# EAGLE design Domino Pi (EAGLE 6.5.0)
Domino breakout Board
DATABASE: ./../Common/BOM/Domino_DB.txt; DRAWN: M.STEMPIN; REV: D
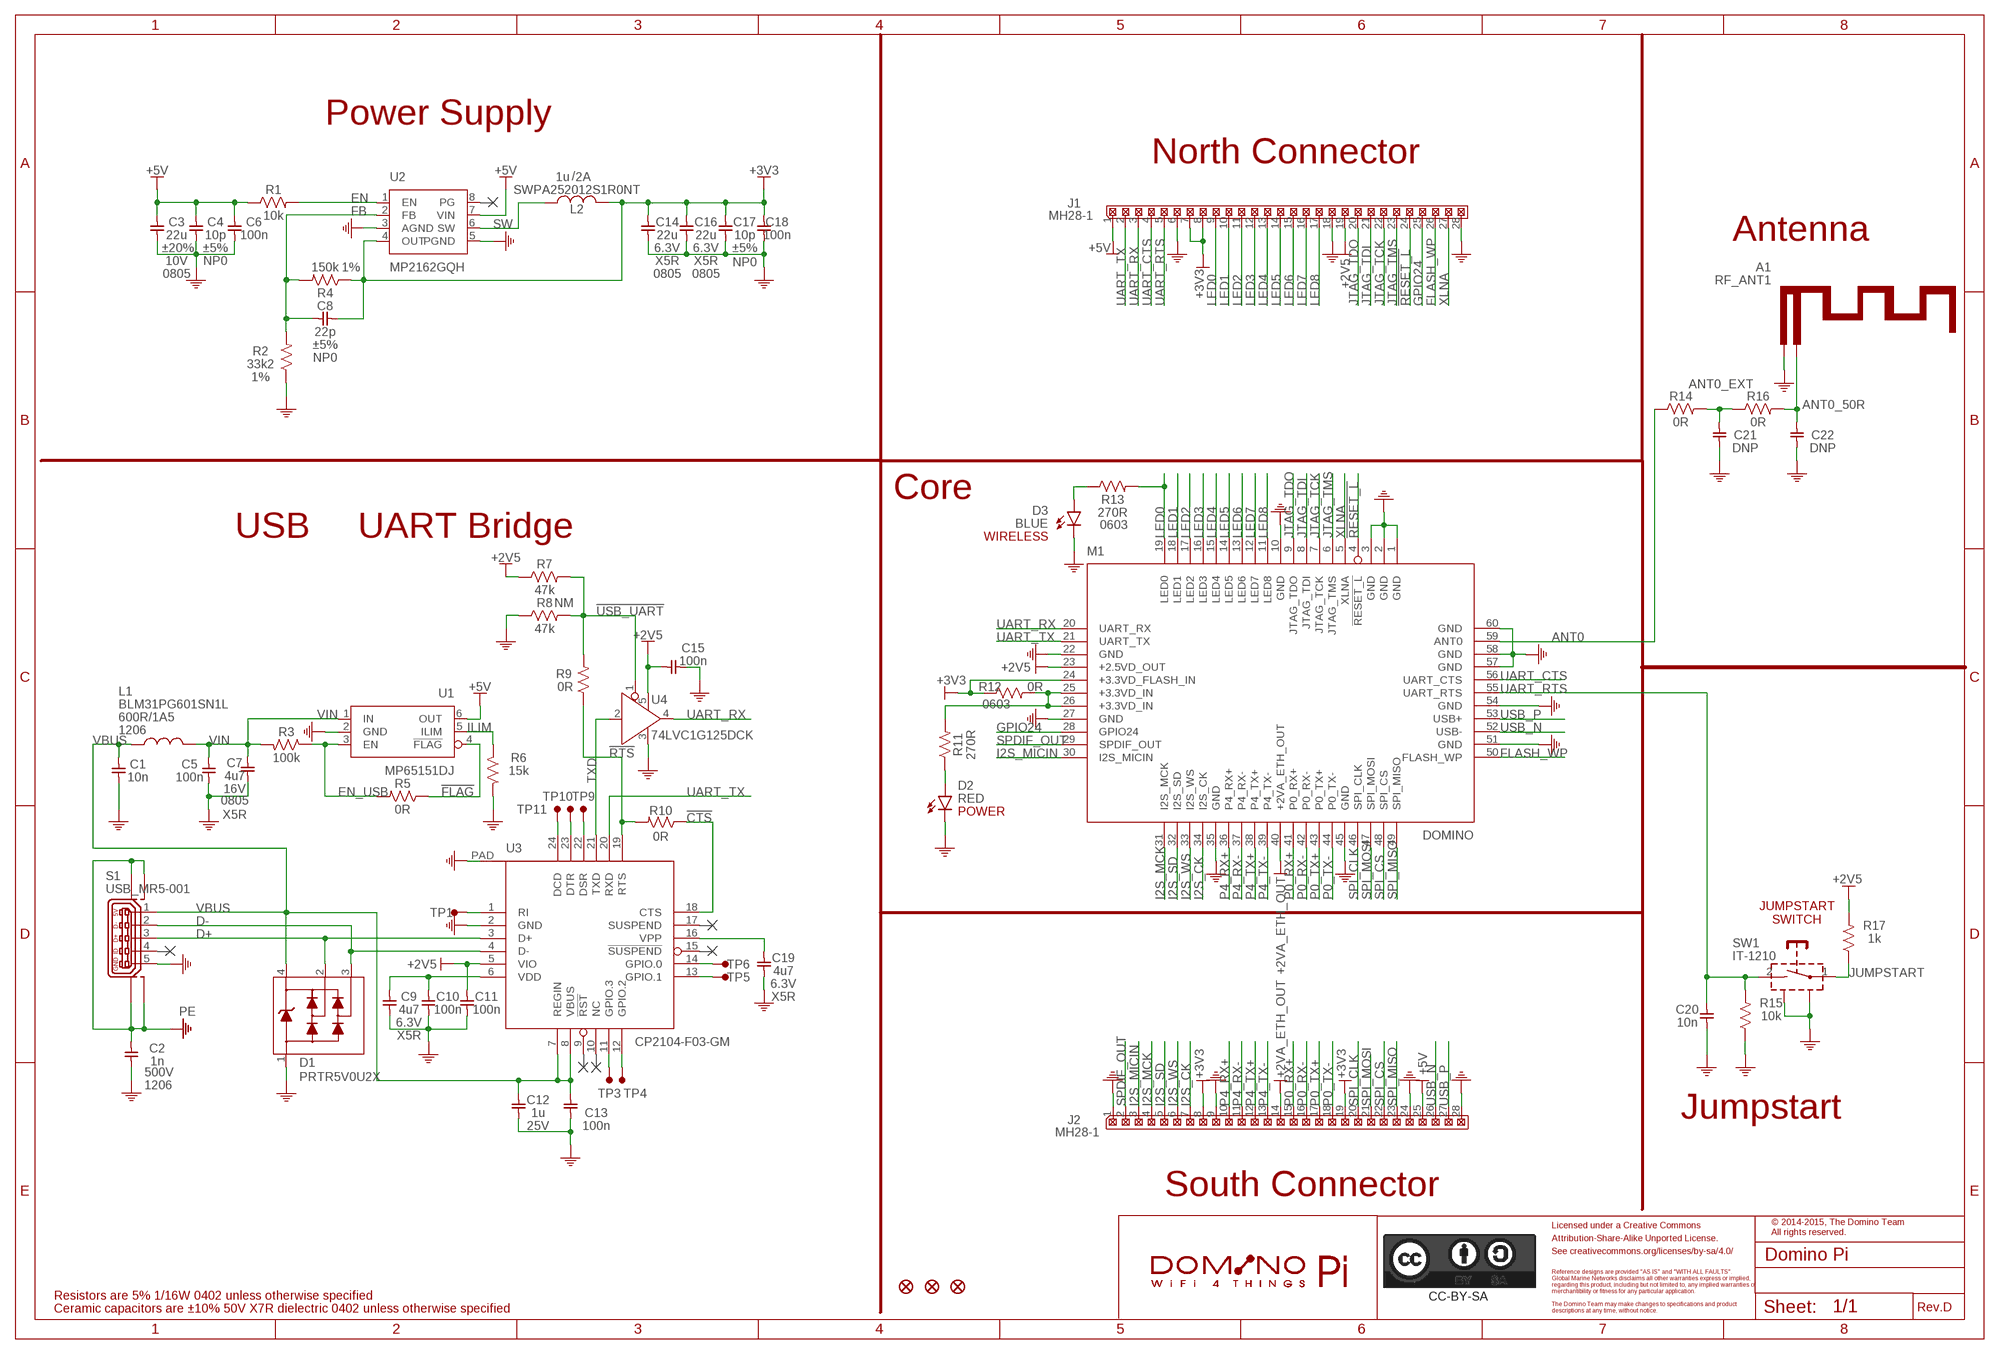
[diagram p0: schematic, sheet 1]
PORT1 (NC): BOM: EXCLUDE
PORT2 (NC): BOM: EXCLUDE
PORT7 (NC): BOM: EXCLUDE
PORT8 (NC): BOM: EXCLUDE
PORT13 (NC): BOM: EXCLUDE
PORT16 (NC): BOM: EXCLUDE

## Parts
A1  RF_ANT1  [RF_ANT1]
C1  10n  CAP_0402  [C0402]
C2  1n  CAP_1206  [C1206]
C3  22u  CAP_0805  [C0805]
C4  10p  CAP_0402  [C0402]
C5  100n  CAP_0402  [C0402]
C6  100n  CAP_0402  [C0402]
C7  4u7  CAP_0805  [C0805]
C8  22p  CAP_0402  [C0402]
C9  4u7  CAP_0402  [C0402]
C10  100n  CAP_0402  [C0402]
C11  100n  CAP_0402  [C0402]
C12  1u  CAP_0402  [C0402]
C13  100n  CAP_0402  [C0402]
C14  22u  CAP_0805  [C0805]
C15  100n  CAP_0402  [C0402]
C16  22u  CAP_0805  [C0805]
C17  10p  CAP_0402  [C0402]
C18  100n  CAP_0402  [C0402]
C19  4u7  CAP_0402  [C0402]
C20  10n  CAP_0402  [C0402]
C21  DNP  CAP_0402  [C0402]
C22  DNP  CAP_0402  [C0402]
CC-BY-SA  CC-BY-SA_LOGO  [CC-BY-SA_LOGO]
D1  PRTR5V0U2X  [SOT143B]
D2  RED  LED_0402  [LED0402]
D3  BLUE  LED_0402  [LED0402]
F1  FIDUCIAL  [FIDUCIAL]
F2  FIDUCIAL  [FIDUCIAL]
F3  FIDUCIAL  [FIDUCIAL]
J1  MH28-1  [MH28-1-0.1]
J2  MH28-1  [MH28-1-0.1]
L1  BLM31PG601SN1L  FB_1206  [FB1206]
L2  SWPA252012S1R0NT  [SWPA252012S]
M1  DOMINO  [DOMINO]
R1  10k  RES_0402  [R0402]
R2  33k2  RES_0402  [R0402]
R3  100k  RES_0402  [R0402]
R4  150k  RES_0402  [R0402]
R5  0R  RES_0402  [R0402]
R6  15k  RES_0402  [R0402]
R7  47k  RES_0402  [R0402]
R8  47k  RES_0402  [R0402]
R9  0R  RES_0402  [R0402]
R10  0R  RES_0402  [R0402]
R11  270R  RES_0402  [R0402]
R12  0R  RES_0603  [R0603]
R13  270R  RES_0603  [R0603]
R14  0R  RES_0402  [R0402]
R15  10k  RES_0402  [R0402]
R16  0R  RES_0402  [R0402]
R17  1k  RES_0402  [R0402]
S1  USB_MR5-001  [USB-MR5-001]
SW1  IT-1210  [IT-1210]
TP1  TEST_PAD  [TEST_PAD]
TP3  TEST_PAD  [TEST_PAD]
TP4  TEST_PAD  [TEST_PAD]
TP5  TEST_PAD  [TEST_PAD]
TP6  TEST_PAD  [TEST_PAD]
TP9  TEST_PAD  [TEST_PAD]
TP10  TEST_PAD  [TEST_PAD]
TP11  TEST_PAD  [TEST_PAD]
U1  MP65151DJ  [SOT23-6]
U2  MP2162GQH  [QFN-8_2X1.5]
U3  CP2104-F03-GM  [QFN-25_4X4]
U4  74LVC1G125DCK  [SC70]
W1  DOMINO_PI_LOGO  [DOMINO_PI_LOGO]

## Nets
!CTS: R10.1 U3.18(CTS)
!FLAG: R5.1 U1.4(!FLAG)
!RESET_L: J1.24 M1.4(!RESET_L)
!RTS: R9.1 R10.2 U3.19(RTS)
!USB_UART: R7.2 R8.2 R9.2 U4.1(!OE)
+2V5: C11.1 C15.2 J1.19 M1.23(+2.5VD_OUT) R7.1 R17.2 U3.5(VIO) U4.5(VCC)
+2VA_ETH_OUT [Ethernet]: J2.14 M1.40(+2VA_ETH_OUT)
+3.3VD_IN: M1.25(+3.3VD_IN) M1.26(+3.3VD_IN) R11.2 R12.2
+3V3: C8.2 C14.1 C16.1 C17.1 C18.1 J1.7 J1.8 J2.8 J2.19 L2.2 M1.24(+3.3VD_FLASH_IN) R4.1 R12.1 U2.4(OUT)
+5V: C3.1 C4.1 C6.1 J1.1 J2.25 R1.1 U1.6(OUT) U2.7(VIN)
ANT0 [RF]: M1.59(ANT0) R14.1
ANT0_50R [RF]: A1.FEED C22.1 R16.2
ANT0_EXT [RF]: C21.1 R14.2 R16.1
BLUE_LED: D3.2(A) R13.1
D+ [USB]: D1.2 S1.3 U3.3(D+)
D- [USB]: D1.3 S1.2 U3.4(D-)
EN: R1.2 U2.1(EN)
EN_USB: R3.1 R5.2 U1.3(EN)
FB: C8.1 R2.2 R4.2 U2.2(FB)
FLASH_WP: J1.26 M1.50(FLASH_WP)
GND: A1.GND C1.2 C2.2 C3.2 C4.2 C5.2 C6.2 C7.2 C9.2 C10.2 C11.2 C12.2 C13.2 C14.2 C15.1 C16.2 C17.2 C18.2 C19.2 C20.2 C21.2 C22.2 D1.1 D2.1(C) D3.1(C) J1.6 J1.18 J1.28 J2.1 J2.9 J2.24 J2.28 M1.1(GND) M1.2(GND) M1.3(GND) M1.10(GND) M1.22(GND) M1.27(GND) M1.35(GND) M1.45(GND) M1.51(GND) M1.54(GND) M1.57(GND) M1.58(GND) M1.60(GND) R2.1 R6.2 R8.1 R15.1 S1.5 SW1.SH$1 SW1.SH$2 U1.2(GND) U2.3(AGND) U2.5(PGND) U3.2(GND) U3.PAD U4.3(GND)
GPIO24: J1.25 M1.28(GPIO24)
I2S_CK: J2.7 M1.34(I2S_CK)
I2S_MCK: J2.4 M1.31(I2S_MCK)
I2S_MICIN: J2.3 M1.30(I2S_MICIN)
I2S_SD: J2.5 M1.32(I2S_SD)
I2S_WS: J2.6 M1.33(I2S_WS)
ILIM: R6.1 U1.5(ILIM)
JTAG_TCK: J1.22 M1.7(JTAG_TCK)
JTAG_TDI: J1.21 M1.8(JTAG_TDI)
JTAG_TDO: J1.20 M1.9(JTAG_TDO)
JTAG_TMS: J1.23 M1.6(JTAG_TMS)
JUMPSTART: R17.1 SW1.1
LED0: J1.9 M1.19(LED0) R13.2
LED1: J1.10 M1.18(LED1)
LED2: J1.11 M1.17(LED2)
LED3: J1.12 M1.16(LED3)
LED4: J1.13 M1.15(LED4)
LED5: J1.14 M1.14(LED5)
LED6: J1.15 M1.13(LED6)
LED7: J1.16 M1.12(LED7)
LED8: J1.17 M1.11(LED8)
N$1: D2.2(A) R11.1
N$2: TP9.1(PP) U3.22(DSR)
N$6: TP1.1(PP) U3.1(RI)
N$8: TP3.1(PP) U3.11(GPIO.3)
N$9: TP4.1(PP) U3.12(GPIO.2)
N$12: TP10.1(PP) U3.23(DTR)
N$13: TP11.1(PP) U3.24(DCD)
N$15: TP6.1(PP) U3.14(GPIO.0)
N$16: TP5.1(PP) U3.13(GPIO.1)
N$31: C19.1 U3.16(VPP)
P0_RX+ [Ethernet]: J2.15 M1.41(P0_RX+)
P0_RX- [Ethernet]: J2.16 M1.42(P0_RX-)
P0_TX+ [Ethernet]: J2.17 M1.43(P0_TX+)
P0_TX- [Ethernet]: J2.18 M1.44(P0_TX-)
P4_RX+ [Ethernet]: J2.10 M1.36(P4_RX+)
P4_RX- [Ethernet]: J2.11 M1.37(P4_RX-)
P4_TX+ [Ethernet]: J2.12 M1.38(P4_TX+)
P4_TX- [Ethernet]: J2.13 M1.39(P4_TX-)
PE: C2.1 S1.SH$1(M0) S1.SH$2(M1) S1.SH$3(M2) S1.SH$4(M3)
SPDIF_OUT: J2.2 M1.29(SPDIF_OUT)
SPI_CLK: J2.20 M1.46(SPI_CLK)
SPI_CS: J2.22 M1.48(SPI_CS)
SPI_MISO: J2.23 M1.49(SPI_MISO)
SPI_MOSI: J2.21 M1.47(SPI_MOSI)
SW: L2.1 U2.6(SW)
TXD: U3.21(TXD) U4.2(A)
UART_CTS: J1.4 M1.56(UART_CTS)
UART_RTS: C20.1 J1.5 M1.55(UART_RTS) R15.2 SW1.2
UART_RX: J1.3 M1.20(UART_RX) U4.4(Y)
UART_TX: J1.2 M1.21(UART_TX) U3.20(RXD)
USB_N [USB]: J2.26 M1.52(USB-)
USB_P [USB]: J2.27 M1.53(USB+)
VBUS: C1.1 C12.1 C13.1 D1.4 L1.2 S1.1 U3.7(REGIN) U3.8(VBUS)
VDD: C9.1 C10.1 U3.6(VDD)
VIN: C5.1 C7.1 L1.1 R3.2 U1.1(IN)
XLNA: J1.27 M1.5(XLNA)
Unconnected: S1.4 U2.8(PG) U3.9(!RST) U3.10(NC) U3.15(!SUSPEND) U3.17(SUSPEND)

## Notes on the sheet
- Power Supply
- North Connector
- /
- Antenna
- Core
- WIRELESS
- USB ⇔ UART Bridge
- NM
- POWER
- JUMPSTART
  SWITCH
- Jumpstart
- South Connector
- Licensed under a Creative Commons
- © 2014-2015, The Domino Team
  All rights reserved.
- Attribution-Share-Alike Unported License.
- See creativecommons.org/licenses/by-sa/4.0/
- Reference designs are provided "AS IS" and "WITH ALL FAULTS".
- Global Marine Networks disclaims all other warranties express or implied,
- regarding this product, including but not limited to, any implied warranties of
- merchantibility or fitness for any particular application.
- Resistors are 5% 1/16W 0402 unless otherwise specified
- The Domino Team may make changes to specifications and product
- Ceramic capacitors are ±10% 50V X7R dielectric 0402 unless otherwise specified | descriptions at any time, without notice. | Rev.

## Library data of the parts
A1 = Domino:RF_ANT1: 2.4 GHz PCB WiFi Antenna; BOM: EXCLUDE; PARTNO: WIFI_ANT-2.4GHz
C1 C20 = Domino:CAP_: Capacitor; PARTNO: C0402_10n_X7R_10%_CER_50V; SIZE: 0402; TC: X7R; TOL: ±10%; TYPE: CER; VOLT: 50V
C2 = Domino:CAP_: Capacitor; PARTNO: C1206_1n_X7R_10%_CER_500V; SIZE: 1206; TC: X7R; TOL: ±10%; TYPE: CER; VOLT: 500V
C3 = Domino:CAP_: Capacitor; PARTNO: C1206_22u_X7R_20%_CER_10V; SIZE: 0805; TC: X7R; TOL: ±20%; TYPE: CER; VOLT: 10V
C4 C17 = Domino:CAP_: Capacitor; PARTNO: C0402_10p_NP0_5%_CER_50V; SIZE: 0402; TC: NP0; TOL: ±5%; TYPE: CER; VOLT: 50V
C5 C6 C10 C11 C13 C15 C18 = Domino:CAP_: Capacitor; PARTNO: C0402_100n_X7R_10%_CER_50V; SIZE: 0402; TC: X7R; TOL: ±10%; TYPE: CER; VOLT: 50V
C7 = Domino:CAP_: Capacitor; PARTNO: C0805_4u7_X5R_10%_CER_16V; SIZE: 0805; TC: X5R; TOL: ±10%; TYPE: CER; VOLT: 16V
C8 = Domino:CAP_: Capacitor; PARTNO: C0402_22p_NP0_5%_CER_50V; SIZE: 0402; TC: NP0; TOL: ±5%; TYPE: CER; VOLT: 50V
C9 C19 = Domino:CAP_: Capacitor; PARTNO: C0402_4u7_X5R_10%_CER_6V3; SIZE: 0402; TC: X5R; TOL: ±10%; TYPE: CER; VOLT: 6.3V
C12 = Domino:CAP_: Capacitor; PARTNO: C0402_1u_X7R_10%_CER_25V; SIZE: 0402; TC: X7R; TOL: ±10%; TYPE: CER; VOLT: 25V
C14 C16 = Domino:CAP_: Capacitor; PARTNO: C0805_22u_X5R_20%_CER_6V3; SIZE: 0805; TC: X5R; TOL: ±20%; TYPE: CER; VOLT: 6.3V
C21 C22 = Domino:CAP_: Capacitor; DNP: T; PARTNO: C0402_DNP; SIZE: 0402
CC-BY-SA = Domino:CC-BY-SA_LOGO: Attribution-Share-Alike Unported License See creativecommons.org/licenses/by-sa/3.0/ for details.; BOM: EXCLUDE
D1 = Domino:PRTR5V0U2X: Ultra low capacitance double rail-to-rail ESD protection diode; PARTNO: PRTR5V0U2X; RATE: 300W; VOLT: 5V
D2 = Domino:LED_: LED; PARTNO: LED0402-RED
D3 = Domino:LED_: LED; PARTNO: LED0402-BLUE
F1-F3 = Domino:FIDUCIAL: Fiducial Mark; BOM: EXCLUDE
J1 J2 = Domino:MH28-1: 28x1 Pin Male Header; PARTNO: MH28-1-0.1
L1 = Domino:FB_: Ferrite Bead; OPT: 600R/1A5; PARTNO: BLM31PG601SN1L; SIZE: 1206
L2 = Domino:SWPA252012S*?: 2.0 x 1.5 mm Footprint 1.2mm Height Shielded Inductor; INDUCTANCE: 1u; PARTNO: SWPA252012SMT; RATE: 2A; TOL: ±30%
M1 = Domino:DOMINO: GL-Connect Domino WiFi Module; PARTNO: DOMINO-CORE
R1 R15 = Domino:RES_: Resistor; PARTNO: R0402_10k_5%_62.5mW; RATE: 62.5mW; SIZE: 0402; TOL: 5%
R2 = Domino:RES_: Resistor; PARTNO: R0402_33k2_1%_62.5mW; RATE: 62.5mW; SIZE: 0402; TOL: 1%
R3 = Domino:RES_: Resistor; PARTNO: R0402_100k_5%_62.5mW; RATE: 62.5mW; SIZE: 0402; TOL: 5%
R4 = Domino:RES_: Resistor; PARTNO: R0402_150k_1%_62.5mW; RATE: 62.5mW; SIZE: 0402; TOL: 1%
R5 R14 R16 = Domino:RES_: Resistor; PARTNO: R0402_0R_5%_62.5mW; RATE: 62.5mW; SIZE: 0402; TOL: 5%
R6 = Domino:RES_: Resistor; PARTNO: R0402_15k_5%_62.5mW; RATE: 62.5mW; SIZE: 0402; TOL: 5%
R7 = Domino:RES_: Resistor; PARTNO: R0402_47k_5%_62.5mW; RATE: 62.5mW; SIZE: 0402; TOL: 5%
R8 = Domino:RES_: Resistor; DNP: T; PARTNO: R0402_47k_5%_62.5mW; RATE: 62.5mW; SIZE: 0402; TOL: 5%
R9 R10 = Domino:RES_: Resistor; PARTNO: R0402_0R_5%_62.5mW; RATE: 125mW; SIZE: 0402; TOL: 5%
R11 = Domino:RES_: Resistor; PARTNO: R0402_270R_5%_62.5mW; RATE: 62.5mW; SIZE: 0402; TOL: 5%
R12 = Domino:RES_: Resistor; PARTNO: R0603_0R_5%_125mW; RATE: 125mW; SIZE: 0603; TOL: 5%
R13 = Domino:RES_: Resistor; PARTNO: R0603_270R_5%_125mW; RATE: 125mW; SIZE: 0603; TOL: 5%
R17 = Domino:RES_: Resistor; PARTNO: R0402_1k_5%_62.5mW; RATE: 62.5mW; SIZE: 0402; TOL: 5%
S1 = Domino:USB_MR5-001: Micro USB Type B Receptacle, 4 Shield Pins SMT; PARTNO: USB MR5-001
SW1 = Domino:IT-1210: Tact Switch SPST, 2 Contacts, 2 Shield Pins; PARTNO: IT-1210
TP1 TP3-TP6 TP9-TP11 = Domino:TEST_PAD: Test Pad; BOM: EXCLUDE
U1 = Domino:MP65151DJ: Precision 60mA-1.7A Programmable Current-Limited Power Distribution Switch; PARTNO: MP65151DJ
U2 = Domino:MP2162: 2A, 6V, 1.5MHz Synchronous Step-Down Switcher; PARTNO: MP2162GQH
U3 = Domino:CP2104-: Single-Chip USB-to-UART Bridge; PARTNO: CP2104-F03-GM
U4 = Domino:74*1G125: Single Bus Buffer Gate With 3-State Output; PARTNO: 74LVC1G125DCK
W1 = Domino:DOMINO_PI_LOGO: Domino Pi Logo; BOM: EXCLUDE

## Net classes
1 USB: width 0.368 mm, clearance 0.152 mm to class 0, clearance 0.152 mm
2 RF: width 0.66 mm, clearance 0.152 mm
3 Ethernet: width 0.254 mm, clearance 0.152 mm to class 0, clearance 0.152 mm to class 1, clearance 0.152 mm to class 2, clearance 0.152 mm

## Board
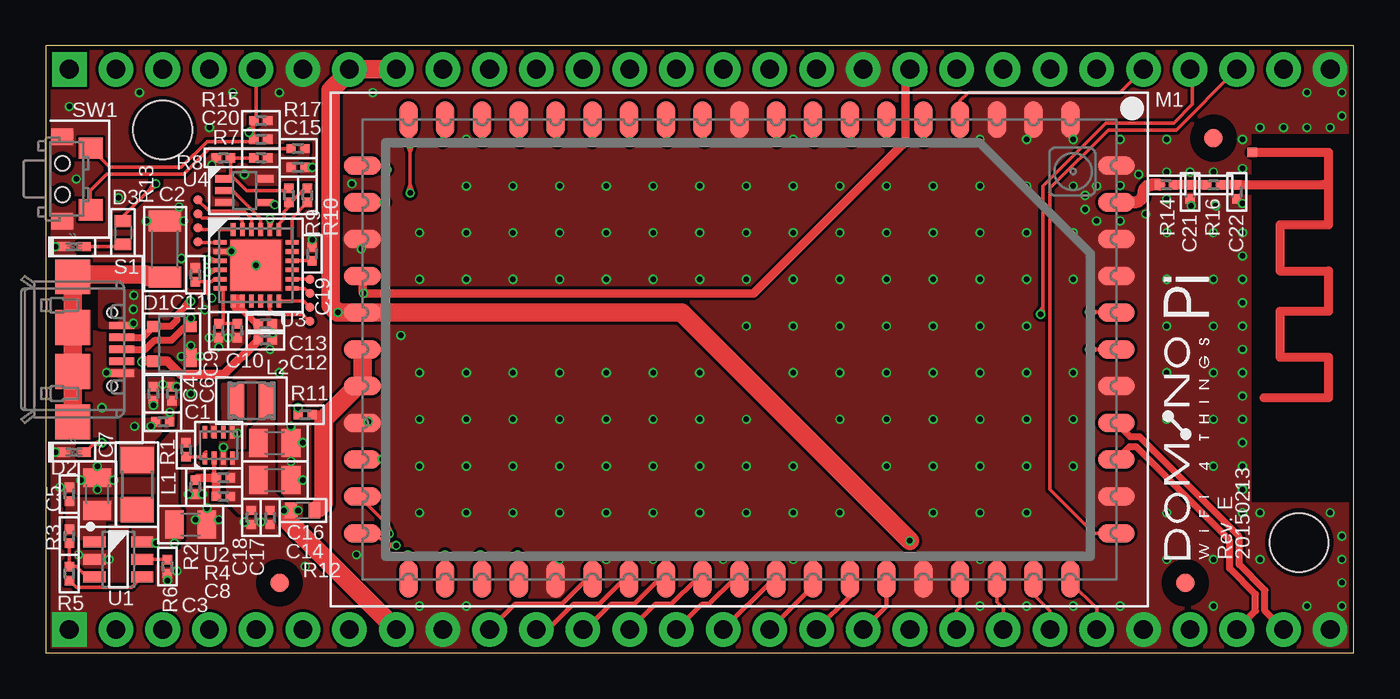
[diagram p1: board, top side]
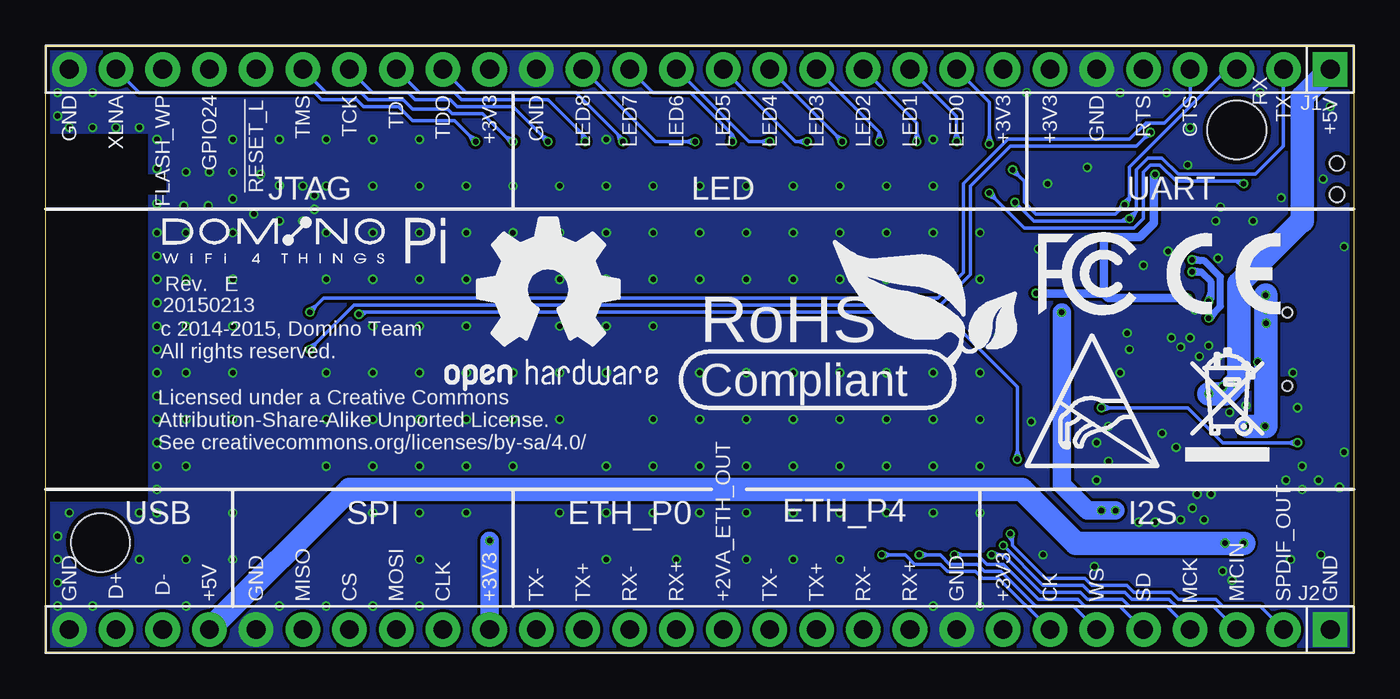
[diagram p2: board, bottom side, seen from below]

Size 71.12 x 33.02 mm. Coordinates in mm from the lower left corner, seen from the top.
Outline: 0,0 71.12,0 71.12,33.02 0,33.02 0,0
Copper layers (1*16): Top 0.043mm / dielectric 1mm / Bottom 0.043mm
Design rules "Domino *": minimum track width 0.1mm, minimum drill 0.3mm, track to track 6mil, track to pad 6mil, pad to pad 6mil, via to via 6mil, smd to smd 0mil, copper to edge 0.25mm, drill to drill 0.35mm, minimum pad ring 0.085mm, minimum via ring 0.1mm, stop-mask expansion 0mil, vias tented up to drill 0.45mm, thermal gap 0.2mm
Holes 3.2 mm at 68.16,6 6.35,28.45

### Footprints (pad centres in the part's own frame; a part is rotated, then mirrored left to right if it is on the bottom)
RF_ANT1 = smd 0.5 x 0.5: FEED 1.75,-0.44; GND 0,0.5
C0402 = smd 0.508 x 0.508: 1 -0.381,0; 2 0.381,0
C1206 = smd 1.143 x 1.778: 1 -1.524,0; 2 1.524,0
C0805 = smd 1.016 x 1.524: 1 -0.889,0; 2 0.889,0
SOT143B = smd 1 x 0.7: 1 -0.75,-1 | smd 0.6 x 0.7: 2 0.95,-1; 3 0.95,1; 4 -0.95,1
LED0402 = smd 0.7 x 0.5: 1 -0.55,0; 2 0.55,0
FIDUCIAL = smd 1.016 x 1.016: 1 0,0
MH28-1-0.1 = drill 1.016 pad 1.88 square: 1 0,0 | drill 1.016 pad 1.88: 2 2.54,0; 3 5.08,0; 4 7.62,0; 5 10.16,0; 6 12.7,0; 7 15.24,0; 8 17.78,0; 9 20.32,0; 10 22.86,0; 11 25.4,0; 12 27.94,0; 13 30.48,0; 14 33.02,0; 15 35.56,0; 16 38.1,0; 17 40.64,0; 18 43.18,0; 19 45.72,0; 20 48.26,0; 21 50.8,0; 22 53.34,0; 23 55.88,0; 24 58.42,0; 25 60.96,0; 26 63.5,0; 27 66.04,0; 28 68.58,0
FB1206 = smd 1.4 x 1.8: 1 -1.35,0; 2 1.35,0
SWPA252012S = smd 2 x 0.85: 1 0,0.825; 2 0,-0.825
DOMINO = smd 2 x 1: 1 -12.5,18; 2 -12.5,16; 3 -12.5,14; 4 -12.5,12; 5 -12.5,10; 6 -12.5,8; 7 -12.5,6; 8 -12.5,4; 9 -12.5,2; 10 -12.5,0; 11 -12.5,-2; 12 -12.5,-4; 13 -12.5,-6; 14 -12.5,-8; 15 -12.5,-10; 16 -12.5,-12; 17 -12.5,-14; 18 -12.5,-16; 19 -12.5,-18; 31 12.5,-18; 32 12.5,-16; 33 12.5,-14; 34 12.5,-12; 35 12.5,-10; 36 12.5,-8; 37 12.5,-6; 38 12.5,-4; 39 12.5,-2; 40 12.5,0; 41 12.5,2; 42 12.5,4; 43 12.5,6; 44 12.5,8; 45 12.5,10; 46 12.5,12; 47 12.5,14; 48 12.5,16; 49 12.5,18 | smd 1 x 2: 20 -10,-20.5; 21 -8,-20.5; 22 -6,-20.5; 23 -4,-20.5; 24 -2,-20.5; 25 0,-20.5; 26 2,-20.5; 27 4,-20.5; 28 6,-20.5; 29 8,-20.5; 30 10,-20.5; 50 10,20.5; 51 8,20.5; 52 6,20.5; 53 4,20.5; 54 2,20.5; 55 0,20.5; 56 -2,20.5; 57 -4,20.5; 58 -6,20.5; 59 -8,20.5; 60 -10,20.5
R0402 = smd 0.508 x 0.508: 1 -0.381,0; 2 0.381,0
R0603 = smd 0.635 x 0.889: 1 -0.635,0; 2 0.635,0
USB-MR5-001 = smd 0.4 x 1.35: 1 -1.3,2.675; 2 -0.65,2.675; 3 0,2.675; 4 0.65,2.675; 5 1.3,2.675 | smd 1.9 x 1.9: SH$1 -3.95,0; SH$2 -1.2,0; SH$3 1.2,0; SH$4 3.95,0 | hole 0.55: -2,2.15; 2,2.15
IT-1210 = smd 1.15 x 1.3: 1 -1.675,-1.55; 2 1.675,-1.55 | smd 0.9 x 1.2: SH$1 -2.3,0; SH$2 2.3,0 | hole 0.8: -0.85,0; 0.85,0
TEST_PAD = smd 0.5 x 0.5: 1 0,0
SOT23-6 = smd 0.6 x 1.2: 1 -0.95,-1.3; 2 0,-1.3; 3 0.95,-1.3; 4 0.95,1.3; 5 0,1.3; 6 -0.95,1.3
QFN-8_2X1.5 = smd 0.6 x 0.25: 1 -0.75,0.75 | smd 0.7 x 0.25: 2 -0.7,0.25; 3 -0.7,-0.25; 4 -0.7,-0.75; 5 0.7,-0.75; 6 0.7,-0.25; 7 0.7,0.25; 8 0.7,0.75
QFN-25_4X4 = smd 0.7 x 0.25: 1 -1.95,1.25; 2 -1.95,0.75; 3 -1.95,0.25; 4 -1.95,-0.25; 5 -1.95,-0.75; 6 -1.95,-1.25; 13 1.95,-1.25; 14 1.95,-0.75; 15 1.95,-0.25; 16 1.95,0.25; 17 1.95,0.75; 18 1.95,1.25 | smd 0.25 x 0.7: 7 -1.25,-1.95; 8 -0.75,-1.95; 9 -0.25,-1.95; 10 0.25,-1.95; 11 0.75,-1.95; 12 1.25,-1.95; 19 1.25,1.95; 20 0.75,1.95; 21 0.25,1.95; 22 -0.25,1.95; 23 -0.75,1.95; 24 -1.25,1.95 | smd 2.75 x 2.75: PAD 0,0
SC70 = smd 0.4 x 1: 1 -0.65,-1.1; 2 0,-1.1; 3 0.65,-1.1; 4 0.65,1.1; 5 -0.65,1.1

### Placement (x,y rotation side)
A1  65.1,27.23 270 top
C1  6.35,12.57 0 top
C2  6.48,21.97 90 top
C3  7.87,6.99 0 top
C4  5.84,14.1 270 top
C5  1.27,8.64 90 top
C6  6.86,14.1 270 top
C7  2.79,8.64 90 top
C8  9.65,8.51 0 top
C9  9.4,17.53 270 top
C10  10.41,17.53 270 top
C11  8.13,20.57 90 top
C12  11.94,17.02 0 top
C13  11.94,17.91 0 top
C14  12.45,9.4 0 top
C15  13.72,26.42 180 top
C16  12.45,11.43 0 top
C17  12.19,7.37 270 top
C18  11.18,7.37 270 top
C19  14.48,21.72 90 top
C20  11.68,27.94 0 top
C21  62.23,25.08 270 top
C22  64.77,25.08 270 top
CC-BY-SA  10.16,-49.53 0 top  (outside the outline)
D1  6.86,16.81 90 top
D2  1.52,10.92 0 top
D3  1.52,22.1 0 top
DRILEGEND  [DRILEGEND]  96.77,62.48 0 top  (outside the outline)
F1  12.7,3.81 0 top
F2  61.98,3.81 0 top
F3  63.5,28 0 top
J1  1.27,31.75 180 bottom
J2  1.27,1.27 180 bottom
L1  4.95,9.14 90 top
L2  11.18,13.72 90 top
M1  37.72,16.51 270 top
R1  7.62,11.05 270 top
R2  8.13,9.02 90 top
R3  1.27,6.35 90 top
R4  9.65,9.53 180 top
R5  1.27,4.32 90 top
R6  6.6,4.7 270 top
R7  11.68,26.92 180 top
R8  9.65,26.92 0 top
R9  13.21,24.89 90 top
R10  14.22,24.89 90 top
R11  14.1,12.95 0 top
R12  13.97,7.75 0 top
R13  4.19,22.86 90 top
R14  60.96,25.46 0 top
R15  11.68,28.96 180 top
R16  63.5,25.46 0 top
R17  13.72,27.43 0 top
S1  1.45,16.51 270 top
SW1  0.89,25.78 90 top
TP1  8.26,22.35 270 top
TP3  14.35,18.03 270 top
TP4  14.35,18.8 270 top
TP5  14.35,19.56 270 top
TP6  14.35,20.32 270 top
TP9  8.26,24.64 270 top
TP10  8.26,23.88 270 top
TP11  8.26,23.11 270 top
U1  3.94,5.08 270 top
U2  9.4,11.3 90 top
U3  11.43,21.08 0 top
U4  10.79,25.15 270 top
U$6  [DOMINO_PI_LOGO_SMALL]  62.23,5.08 90 top
U$8  [DOMINO_PI_LOGO_SMALL]  64.77,22.23 0 bottom
U$28  [A5L-LOC]  -40.64,-60.96 0 top  (outside the outline)
U$36  [ESD_LOGO]  17.78,10.16 0 bottom
U$38  [OPEN_HARDWARE_LOGO]  43.81,19.68 0 bottom
U$39  [RECYCLE_BIN_LOGO]  9.14,10.41 0 bottom
U$40  [ROHS_LOGO]  35.56,13.97 0 bottom
U$41  [CE_LOGO_SMALL]  10.16,18.41 0 bottom
U$42  [FCC_LOGO_SMALL]  17.14,18.41 0 bottom
W1  -33.02,-46.99 0 top  (outside the outline)

### Tracks (layer width: path | path; a pad name or v marks a point on that pad's centre or on a via)
!CTS
  Top 0.203: U3.18 13.38,23.67 R10.1
!FLAG
  Top 0.203: R5.1 1.65,3.56 4.66,3.56 U1.4
!RESET_L
  Top 0.203: M1.4 49.72,30.03 50.16,30.48 58.42,30.48 J1.24
!RTS
  Top 0.203: R10.2 14.1,25.27 13.34,24.51 R9.1 13.21,24.26 12.95,24 12.95,23.62 12.68,23.35 U3.19
!USB_UART
  Top 0.203: 9.71,25.78 U4.1 10.03,25.8 | 10.03,25.8 10.27,25.8 10.92,25.15 13.08,25.15 R9.2 | 10.03,25.8 R8.2 R7.2
+2V5  (via drill 0.3 pad 0.03)
  Top 0.203: R17.2 14.1,27.3 | C11.1 8.76,20.19 | 8.76,20.19 9.02,20.19 9.16,20.33 U3.5 | 8.76,20.19 8.76,19.56 v9.02,19.3
  Top 0.457: J1.19 46.74,31.5 46.74,27.81 38.48,19.56 v17.27,19.56 17.22,19.61 M1.23
  Bottom 0.457: v10.79,26.04 10.87,25.96 10.87,23.37 11.62,22.62 13.59,22.62 13.59,19.56 | v9.02,19.3 13.34,19.3 13.59,19.56 | v17.27,19.56 13.59,19.56
  pour Top (no thermals): 9.78,27.56 14.22,27.56 14.22,26.8 13.59,26.8 13.59,25.78 13.46,25.78 13.46,25.15 9.78,25.15
+2VA_ETH_OUT
  Top 0.254: M1.40 37.41,4.01 36.07,2.67 35.69,2.67 J2.14
+3.3VD_IN
  Top 0.508: R12.2 14.73,7.75 14.86,7.87 | R11.2 14.86,12.95 15.11,12.7
  Top 1.016: M1.25 M1.26 16.92,14.51 15.11,12.7 15.11,8.13 14.86,7.87
+3V3  (via drill 0.3, 0.3 pad 0.03)
  Top 0.254: C16.1 11.81,11.68 11.81,11.94 11.94,12.06
  Top 0.61: 11.43,9.53 C14.1
  Top 1.016: J1.8 J1.7 16.51,31.62 15.49,30.61 15.49,18.9 v15.88,18.52 M1.24 34.58,18.51 v46.99,6.1 | J2.8 13.21,7.11 13.21,7.37
  Bottom 1.016: J2.19 v46.99,6.1 | v15.88,18.52 15.88,9.14 14.48,7.75 v12.95,7.75
  other vias: 13.72,7.75
  pour Top (no thermals): 10.16,10.82 11.18,10.82 11.18,12.12 11.68,12.62 11.68,14.58 12.32,14.61 12.32,12.4 12.34,8.66 12.93,8.08 13.84,8.08 13.84,7.37 12.83,7.37 12.83,7.32 12.47,7.65 10.59,7.62 9.91,8.31 9.91,9.73 10.16,9.98
+5V  (via drill 0.3, 0.3 pad 0.03)
  Bottom 1.27: J1.1 2.79,30.23 2.79,23.5 2.85,23.5 6.25,20.09 6.25,14.83 6.99,14.1 v7.87,14.1 | J2.25 54.61,8.89 18.03,8.89 15.11,5.97 v5.97,5.97
  other vias: 6.35,14.61 7.11,14.48 6.99,5.97
  pour Top (no thermals): 4.75,5.84 7.11,5.84 7.11,5.97 7.37,6.22 7.37,7.75 7.11,8 7.11,11.1 7.32,11.28 8.1,11.28 8.64,11.81 9.17,11.79 9.17,14.91 5.59,14.91 5.59,14.35 7.11,14.35 7.49,13.97 7.49,13.34 7.24,13.08 7.24,12.45 6.22,11.3 6.17,6.96 6.17,6.78 4.75,6.78
ANT0
  Top 0.66: 57.78,24.51 M1.59 59.18,24.51 arc90 59.69,25.02 arc-90 60.13,25.46 R14.1
ANT0_50R
  Top 0.508: R16.2 C22.1 64.64,25.46 A1.FEED
ANT0_EXT
  Top 0.508: R14.2 C21.1 R16.1
BLUE_LED
  Top 0.203: D3.2 4.06,22.1 R13.1
D+  (via drill 0.3, 0.3 pad 0.03)
  Top 0.254: U3.3 9.23,21.33 | 9.23,21.33 8.84,21.33 v8.79,21.39 | 9.23,21.33 8.84,21.5 v8.79,21.39 | 9.23,21.33 8.81,21.27 v8.79,21.39
  Top 0.368: S1.3 5.41,16.51 5.92,17.02 6.83,17.02 7.52,17.7 7.77,17.7 7.83,17.76 | v7.87,18.21 7.87,17.78 D1.2 7.83,17.77 7.83,17.76 | 7.83,17.76 7.94,18.2 v7.87,18.21 | 7.83,17.76 7.81,18.21 v7.87,18.21
  Bottom 0.368: v7.87,18.21 7.56,18.53 | 7.56,18.53 7.24,18.85 7.24,20.45 8.13,21.34 8.34,21.34 | 8.34,21.34 8.74,21.34 v8.79,21.39 | 8.34,21.34 8.79,21.32 v8.79,21.39 | 8.34,21.34 8.77,21.45 v8.79,21.39 | 7.56,18.53 7.82,18.17 v7.87,18.21 | 7.56,18.53 7.91,18.27 v7.87,18.21
D-  (via drill 0.3, 0.3 pad 0.03)
  Top 0.254: 9.23,20.83 8.89,20.83 v8.79,20.73 | 9.23,20.83 U3.4 | 9.23,20.83 8.79,20.85 v8.79,20.73 | 9.23,20.83 8.85,20.62 v8.79,20.73
  Top 0.368: S1.2 5.25,17.16 D1.3 6.79,17.77 7.11,18.09 7.11,18.36 7.56,18.81 | v7.87,19.13 7.56,18.81 | 7.56,18.81 7.91,19.07 v7.87,19.13 | 7.56,18.81 7.82,19.16 v7.87,19.13
  Bottom 0.368: v8.79,20.73 8.34,20.73 | 8.34,20.73 8.28,20.73 7.77,20.22 7.77,19.57 | 7.77,19.57 7.77,19.23 v7.87,19.13 | 8.34,20.73 8.78,20.66 v8.79,20.73 | 8.34,20.73 8.78,20.79 v8.79,20.73 | 7.77,19.57 7.81,19.12 v7.87,19.13 | 7.77,19.57 7.93,19.15 v7.87,19.13
EN
  Top 0.203: U2.1 8.53,10.67 R1.2
EN_USB
  Top 0.203: R3.1 R5.2 1.65,4.7 2.22,4.13 U1.3
FB
  Top 0.203: 9.15,9.65 R4.2
  Top 0.254: U2.2 9.15,9.65
  Top 0.457: C8.1 R4.2 8.26,9.53 R2.2
FLASH_WP
  Top 0.203: M1.50 56.99,6.51 54.61,8.89 54.61,25.27 57.78,28.45 61.47,28.45 J1.26
GND  (via drill 0.3, 0.3 pad 0.03)
  Top 0.203: C9.2 9.34,17.14 | 9.34,17.14 8.91,17.14 | 9.34,17.14 8.94,17.29 v8.89,17.14 8.94,17 9.34,17.14
  Top 0.254: C10.2 C9.2 | U3.2 9.49,21.84 9.63,21.84 | 9.63,21.84 v10.08,21.84 | U3.PAD 11.11,21.4 | 11.11,21.4 10.67,21.84 10.53,21.84 | v10.08,21.84 10.53,21.84 | 11.11,21.4 11.32,21.02 U3.PAD | 11.11,21.4 11.49,21.19 U3.PAD | 9.63,21.84 10.05,21.73 v10.08,21.84 | 9.63,21.84 10.05,21.96 v10.08,21.84 | 10.53,21.84 10.12,21.96 v10.08,21.84 | 10.53,21.84 10.12,21.73 v10.08,21.84
  other vias: 25.4,25.4 27.94,25.4 30.48,25.4 45.72,25.4 57.15,25.4 59.44,26.04 60.96,24.7 63.5,22.86 50.8,22.86 45.72,22.86 27.94,20.32 30.48,20.32 33.02,20.32 35.56,20.32 38.1,20.32 40.64,20.32 45.72,20.32 50.8,20.32 22.86,15.24 3.3,15.24 20.32,12.7 27.94,15.24 30.48,15.24 33.02,15.24 35.56,15.24 43.18,15.24 45.72,15.24 50.8,15.24 60.96,12.7 50.8,12.7 45.72,12.7 38.1,12.7 35.56,12.7 33.02,12.7 27.94,12.7 25.4,12.7 27.94,10.16 30.48,10.16 33.02,10.16 35.56,10.16 38.1,10.16 40.64,10.16 63.5,10.16 55.88,2.54 57.15,23.5 56.52,24.13 56.52,24.89 58.42,25.43 58.42,23.5 60.96,26.16 59.82,23.88 62.23,26.16 9.65,11.18 11.43,21.08 38.1,22.86 33.02,22.86 30.48,22.86 27.94,22.86 25.4,22.86 43.18,20.32 25.4,10.16 22.86,20.32 63.5,5.08 58.42,2.54 22.86,10.16 22.86,25.4 33.02,25.4 35.56,22.86 35.56,25.4 38.1,25.4 40.64,25.4 40.64,22.86 43.18,22.86 27.94,5.08 3.94,24.77 7.75,8.64 13.97,9.4 9.91,17.14 68.58,30.48 60.96,27.94 58.42,27.94 53.34,27.94 50.8,27.94 50.8,25.4 53.34,25.4 53.34,22.86 53.34,20.32 53.34,15.24 53.34,12.7 53.34,10.16 50.8,10.16 45.72,10.16 43.18,12.7 40.64,15.24 60.96,7.62 60.96,5.08 63.5,2.54 30.48,12.7 17.78,30.48 20.32,20.32 20.32,15.24 43.18,25.4 40.64,27.94 22.86,27.94 55.88,22.86 55.88,20.32 55.88,15.24 55.88,12.7 55.88,10.16 55.88,25.4 68.58,2.54 30.48,5.08 33.02,5.08 36.83,5.08 40.64,5.08 50.8,5.08 53.34,2.54 50.8,2.54 48.26,25.4 48.26,22.86 48.26,20.32 48.26,15.24 48.26,12.7 48.26,10.16 7.24,24.26 5.46,23.5 7.37,21.46 14.48,26.42 6.73,13.08 13.34,10.41 13.34,12.32 13.97,11.43 9.02,26.54 8.51,8.64 5.84,13.46 20.32,22.86 20.32,2.54 22.86,2.54 55.88,27.94 66.04,5.08 8.64,18.67 14.48,22.48 12.32,17.4 12.19,16.51 8.13,7.24 10.41,11.94 0.51,10.92 0.51,22.1 12.7,30.48 10.16,30.48 5.08,30.48 7.49,23.5 63.5,12.7 63.5,15.24 60.96,15.24 60.96,17.78 63.5,17.78 63.5,20.32 60.96,20.32 60.96,22.86 62.29,24.32 63.63,24.32 65.09,24.45 63.5,26.16 65.09,26.35 65.09,20.32 65.09,21.59 65.09,22.86 65.09,19.05 65.09,17.78 65.09,16.51 65.09,15.24 65.09,13.97 65.09,12.7 65.09,11.43 65.09,10.16 65.09,8.89 65.09,7.62 66.04,7.62 69.85,7.62 70.48,6.35 70.48,5.08 70.48,3.81 70.48,2.54 65.09,27.94 66.04,28.57 67.31,28.57 68.58,28.57 69.85,28.57 70.48,29.21 70.48,30.48 1.65,25.78 9.4,16.64 8.38,16.13 7.87,16.71 7.37,16.13 9.4,7.24 6.6,3.94 7.11,4.45 1.78,5.33 3.43,5.08 2.79,10.16 2.79,8.89 3.68,9.4 1.91,9.4 0.76,9.02 8.76,7.87 10.79,7.11 11.68,7.11 12.7,15.24 25.4,15.24 22.86,12.7 20.32,10.16 40.64,17.78 43.18,17.78 45.72,17.78 48.26,17.78 50.8,17.78 53.34,17.78 38.1,17.78 20.32,7.62 22.86,7.62 25.4,7.62 27.94,7.62 30.48,7.62 33.02,7.62 35.56,7.62 38.1,7.62 40.64,7.62 43.18,7.62 48.26,7.62 50.8,7.62 53.34,7.62 25.4,20.32 22.86,22.86 1.27,29.72 8.89,28.57 17.14,21.97 16.64,25.53 14.1,4.7 16.89,5.33 17.53,12.57 19.3,17.27 3.05,13.34
  pour Top (rank 3, no thermals): 0,33 71.62,33 71.62,0 0,0 0,12.7 0,20.32
  pour Bottom (no thermals): 0,33 71.62,33 71.62,0 0,0 0,12.7 0,20.32
GPIO24  (via drill 0.3 pad 0.03)
  Top 0.203: v18.29,10.54 17.84,10.54 | 17.84,10.54 17.25,10.54 M1.28 | J1.25 62.36,31.62 62.36,29.84 61.34,28.83 57.66,28.83 54.23,25.4 54.23,18.85 | 54.23,18.85 54.23,18.54 v54.1,18.41 | 17.84,10.54 18.24,10.4 v18.29,10.54 | 17.84,10.54 18.24,10.68 v18.29,10.54 | 54.23,18.85 53.98,18.5 v54.1,18.41 | 54.23,18.85 54.25,18.42 v54.1,18.41
  Bottom 0.203: 53.67,18.54 22.35,18.54 18.29,14.48 18.29,10.99 | 53.67,18.54 53.98,18.54 v54.1,18.41 | v18.29,10.54 18.29,10.99 | 18.29,10.99 18.15,10.59 v18.29,10.54 | 18.29,10.99 18.43,10.59 v18.29,10.54 | 53.67,18.54 54.02,18.29 v54.1,18.41 | 53.67,18.54 54.09,18.56 v54.1,18.41
I2S_CK  (via drill 0.3 pad 0.03)
  Top 0.254: M1.34 25.72,4.89 | 25.72,4.89 25.72,5.27 v25.65,5.33 | 25.72,4.89 25.78,5.32 v25.65,5.33 | 25.72,4.89 25.54,5.28 v25.65,5.33
  Bottom 0.203: v25.65,5.33 25.2,5.33 | 25.2,5.33 24.38,5.33 23.88,4.83 22.48,4.83 22.1,4.45 20.57,4.45 20.19,4.06 19.3,4.06 J2.7 | 25.2,5.33 25.61,5.19 v25.65,5.33 | 25.2,5.33 25.61,5.47 v25.65,5.33
I2S_MCK  (via drill 0.3 pad 0.03)
  Top 0.254: M1.31 19.72,4.88 | 19.72,4.88 19.72,5.3 v19.68,5.33 | 19.72,4.88 19.81,5.31 v19.68,5.33 | 19.72,4.88 19.57,5.29 v19.68,5.33
  Bottom 0.203: v19.68,5.33 19.23,5.33 | 19.23,5.33 19.05,5.33 17.02,3.3 14.86,3.3 14.48,2.92 12.57,2.92 12.19,2.54 10.16,2.54 J2.4 | 19.23,5.33 19.64,5.19 v19.68,5.33 | 19.23,5.33 19.64,5.47 v19.68,5.33
I2S_MICIN  (via drill 0.3 pad 0.03)
  Top 0.203: M1.30 17.87,6.51 18.54,5.84 18.6,5.84 | 18.6,5.84 v19.05,5.84 | 18.6,5.84 19,5.7 v19.05,5.84 | 18.6,5.84 19,5.98 v19.05,5.84
  Bottom 0.203: v19.05,5.84 16.89,3.68 14.73,3.68 14.35,3.3 12.45,3.3 12.06,2.92 10.03,2.92 9.65,2.54 7.62,2.54 J2.3
I2S_SD  (via drill 0.3 pad 0.03)
  Top 0.254: M1.32 21.72,4.88 | 21.72,4.88 v21.72,5.33 | 21.72,4.88 21.84,5.3 v21.72,5.33 | 21.72,4.88 21.6,5.3 v21.72,5.33
  Bottom 0.203: v21.72,5.33 21.27,5.33 | 21.27,5.33 20.45,5.33 19.94,4.83 19.05,4.83 17.14,2.92 14.99,2.92 14.61,2.54 12.7,2.54 J2.5 | 21.27,5.33 21.67,5.19 v21.72,5.33 | 21.27,5.33 21.67,5.47 v21.72,5.33
I2S_WS  (via drill 0.3 pad 0.03)
  Top 0.254: M1.33 23.72,4.89 | 23.72,4.89 23.72,5.24 v23.62,5.33 | 23.72,4.89 23.75,5.33 v23.62,5.33 | 23.72,4.89 23.51,5.28 v23.62,5.33
  Bottom 0.203: v23.62,5.33 23.17,5.33 | 23.17,5.33 22.48,5.33 21.97,4.83 20.45,4.83 20.07,4.45 19.18,4.45 17.27,2.54 15.24,2.54 J2.6 | 23.17,5.33 23.57,5.19 v23.62,5.33 | 23.17,5.33 23.57,5.47 v23.62,5.33
ILIM
  Top 0.203: U1.5 R6.1
JTAG_TCK  (via drill 0.3 pad 0.03)
  Top 0.203: M1.7 43.72,28.25 | 43.72,28.25 43.72,27.91 v43.81,27.81 | 43.72,28.25 43.67,27.83 v43.81,27.81 | 43.72,28.25 43.94,27.89 v43.81,27.81
  Bottom 0.203: v43.81,27.81 44.13,28.13 | 44.13,28.13 45.72,29.72 48.77,29.72 49.15,30.1 51.05,30.1 51.44,30.48 53.34,30.48 J1.22 | 44.13,28.13 43.75,27.95 v43.81,27.81 | 44.13,28.13 43.95,27.75 v43.81,27.81
JTAG_TDI  (via drill 0.3 pad 0.03)
  Top 0.203: M1.8 41.72,28.26 | 41.72,28.26 41.72,27.88 v41.78,27.81 | 41.72,28.26 41.64,27.84 v41.78,27.81 | 41.72,28.26 41.91,27.88 v41.78,27.81
  Bottom 0.203: v41.78,27.81 41.78,28.07 41.95,28.23 | 41.95,28.23 43.81,30.1 48.51,30.1 48.9,30.48 50.8,30.48 J1.21 | 41.95,28.23 41.67,27.91 v41.78,27.81 | 41.95,28.23 41.93,27.81 v41.78,27.81
JTAG_TDO  (via drill 0.3 pad 0.03)
  Top 0.203: M1.9 39.72,28.26 | 39.72,28.26 39.72,27.84 v39.75,27.81 | 39.72,28.26 39.61,27.85 v39.75,27.81 | 39.72,28.26 39.89,27.87 v39.75,27.81
  Bottom 0.203: J1.20 48.26,30.48 42.29,30.48 40,28.19 | v39.75,27.81 39.75,27.94 40,28.19 | 40,28.19 39.66,27.93 v39.75,27.81 | 40,28.19 39.9,27.78 v39.75,27.81
JTAG_TMS  (via drill 0.3 pad 0.03)
  Top 0.203: M1.6 45.72,28.26 | 45.72,28.26 v45.72,27.81 | 45.72,28.26 45.58,27.86 v45.72,27.81 | 45.72,28.26 45.86,27.86 v45.72,27.81
  Bottom 0.203: v45.72,27.81 45.85,27.81 46.09,28.06 | 46.09,28.06 47.37,29.34 49.02,29.34 49.28,29.59 51.18,29.59 51.69,30.1 53.59,30.1 53.98,30.48 55.88,30.48 J1.23 | 46.09,28.06 45.68,27.96 v45.72,27.81 | 46.09,28.06 45.84,27.72 v45.72,27.81
JUMPSTART
  Top 0.203: R17.1 8.89,27.43 7.49,26.04 3.3,26.04 2.41,25.15 2.41,24.13 SW1.1
LED0  (via drill 0.3, 0.3 pad 0.03)
  Top 0.203: v19.81,27.69 19.81,28.14 | 19.81,28.14 19.81,28.92 M1.19 | v19.81,25.02 19.81,25.47 | 19.81,25.47 19.81,27.24 | 19.81,27.24 v19.81,27.69 | v5.97,25.53 5.65,25.21 | 5.65,25.21 4.19,23.75 R13.2 | 19.81,28.14 19.67,27.73 v19.81,27.69 | 19.81,28.14 19.95,27.73 v19.81,27.69 | 19.81,27.24 19.95,27.64 v19.81,27.69 | 19.81,27.24 19.67,27.64 v19.81,27.69 | 19.81,25.47 19.67,25.07 v19.81,25.02 | 19.81,25.47 19.95,25.07 v19.81,25.02 | 5.65,25.21 6.03,25.39 v5.97,25.53 | 5.65,25.21 5.83,25.59 v5.97,25.53
  Bottom 0.203: 19.49,24.7 17.91,23.11 11.94,23.11 11.43,23.62 11.43,26.16 11.05,26.54 10.54,26.54 9.65,25.65 6.4,25.65 | 19.49,24.7 v19.81,25.02 | v19.81,27.69 19.81,28.14 | 19.81,28.14 19.81,29.97 J1.9 | 6.4,25.65 6.1,25.65 v5.97,25.53 | 19.81,28.14 19.67,27.73 v19.81,27.69 | 19.81,28.14 19.95,27.73 v19.81,27.69 | 19.49,24.7 19.88,24.89 v19.81,25.02 | 19.49,24.7 19.68,25.08 v19.81,25.02 | 6.4,25.65 5.98,25.68 v5.97,25.53 | 6.4,25.65 6.05,25.41 v5.97,25.53
LED1  (via drill 0.3 pad 0.03)
  Top 0.203: M1.18 21.72,28.24 | 21.72,28.24 21.72,27.94 v21.59,27.81 | 21.72,28.24 21.47,27.9 v21.59,27.81 | 21.72,28.24 21.74,27.82 v21.59,27.81
  Bottom 0.203: v21.59,27.81 21.59,28.26 | 21.59,28.26 21.59,29.21 J1.10 | 21.59,28.26 21.45,27.86 v21.59,27.81 | 21.59,28.26 21.73,27.86 v21.59,27.81
LED2  (via drill 0.3 pad 0.03)
  Top 0.203: M1.17 23.72,28.26 | 23.72,28.26 23.72,27.84 v23.75,27.81 | 23.72,28.26 23.61,27.85 v23.75,27.81 | 23.72,28.26 23.89,27.87 v23.75,27.81
  Bottom 0.203: J1.11 23.75,28.83 23.75,28.26 | 23.75,28.26 v23.75,27.81 | 23.75,28.26 23.61,27.86 v23.75,27.81 | 23.75,28.26 23.89,27.86 v23.75,27.81
LED3  (via drill 0.3 pad 0.03)
  Top 0.203: M1.16 25.72,28.26 | 25.72,28.26 25.72,27.88 v25.78,27.81 | 25.72,28.26 25.64,27.84 v25.78,27.81 | 25.72,28.26 25.91,27.88 v25.78,27.81
  Bottom 0.203: v25.78,27.81 25.78,28.26 | 25.78,28.26 25.78,28.32 J1.12 | 25.78,28.26 25.64,27.86 v25.78,27.81 | 25.78,28.26 25.92,27.86 v25.78,27.81
LED4  (via drill 0.3 pad 0.03)
  Top 0.203: M1.15 27.72,28.25 | 27.72,28.25 27.72,27.91 v27.81,27.81 | 27.72,28.25 27.67,27.83 v27.81,27.81 | 27.72,28.25 27.94,27.89 v27.81,27.81
  Bottom 0.203: v27.81,27.81 28.13,28.13 | 28.13,28.13 J1.13 | 28.13,28.13 27.75,27.95 v27.81,27.81 | 28.13,28.13 27.95,27.75 v27.81,27.81
LED5  (via drill 0.3 pad 0.03)
  Top 0.203: M1.14 29.72,28.26 | 29.72,28.26 v29.72,27.81 | 29.72,28.26 29.58,27.86 v29.72,27.81 | 29.72,28.26 29.86,27.86 v29.72,27.81
  Bottom 0.203: J1.14 30.35,27.81 30.17,27.81 | v29.72,27.81 30.17,27.81 | 30.17,27.81 29.77,27.95 v29.72,27.81 | 30.17,27.81 29.77,27.67 v29.72,27.81
LED6  (via drill 0.3 pad 0.03)
  Top 0.203: M1.13 31.72,28.26 | 31.72,28.26 31.72,27.84 v31.75,27.81 | 31.72,28.26 31.61,27.85 v31.75,27.81 | 31.72,28.26 31.89,27.87 v31.75,27.81
  Bottom 0.203: J1.15 32.89,27.81 32.2,27.81 | 32.2,27.81 v31.75,27.81 | 32.2,27.81 31.8,27.95 v31.75,27.81 | 32.2,27.81 31.8,27.67 v31.75,27.81
LED7  (via drill 0.3 pad 0.03)
  Top 0.203: M1.12 33.72,28.26 | 33.72,28.26 33.72,27.88 v33.78,27.81 | 33.72,28.26 33.64,27.84 v33.78,27.81 | 33.72,28.26 33.91,27.88 v33.78,27.81
  Bottom 0.203: J1.16 38.1,30.48 36.07,30.48 33.85,28.26 | 33.85,28.26 33.78,28.19 v33.78,27.81 | 33.85,28.26 33.65,27.88 v33.78,27.81 | 33.85,28.26 33.93,27.84 v33.78,27.81
LED8  (via drill 0.3 pad 0.03)
  Top 0.203: M1.11 35.72,28.25 | 35.72,28.25 35.72,27.91 v35.81,27.81 | 35.72,28.25 35.67,27.83 v35.81,27.81 | 35.72,28.25 35.94,27.89 v35.81,27.81
  Bottom 0.203: 36.26,27.81 37.97,27.81 J1.17 | 36.26,27.81 v35.81,27.81 | 36.26,27.81 35.86,27.95 v35.81,27.81 | 36.26,27.81 35.86,27.67 v35.81,27.81
N$1  (via drill 0.3)
  Top 0.203: D2.2 2.16,10.92 2.6,11.37 | 2.6,11.37 2.67,11.43 v3.05,11.43 | R11.1 v13.72,13.34 | 2.6,11.37 3.02,11.28 v3.05,11.43 | 2.6,11.37 2.98,11.56 v3.05,11.43
  Bottom 0.203: v3.05,11.43 3.5,11.43 | 3.5,11.43 7.11,11.43 9.02,13.34 13.27,13.34 | v13.72,13.34 13.27,13.34 | 3.5,11.43 3.1,11.57 v3.05,11.43 | 3.5,11.43 3.1,11.29 v3.05,11.43 | 13.27,13.34 13.67,13.2 v13.72,13.34 | 13.27,13.34 13.67,13.47 v13.72,13.34
N$2
  Top 0.203: U3.22 11.18,23.62 10.77,24.03 8.87,24.03 TP9.1
N$3
  cutout Top: 8.38,11.56 9.4,11.56 9.4,11.05 8.38,11.05
N$6
  Top 0.203: U3.1 8.28,22.33 TP1.1
N$8
  Top 0.203: U3.11 12.18,18.68 12.45,18.41 13.97,18.41 TP3.1
N$9
  Top 0.203: U3.12 14.02,19.13 TP4.1
N$12
  Top 0.203: U3.23 10.67,23.04 10.67,23.5 10.52,23.65 8.48,23.65 TP10.1
N$13
  Top 0.203: U3.24 8.34,23.03 TP11.1
N$15
  Top 0.203: U3.14 14.34,20.33 TP6.1
N$16
  Top 0.203: U3.13 14.08,19.83 TP5.1
N$31
  Top 0.203: U3.16 C19.1
P0_RX+
  Top 0.254: M1.41 39.57,4.01 J2.15
P0_RX-
  Top 0.254: M1.42 41.72,3.62 J2.16
P0_TX+
  Top 0.254: M1.43 43.72,3.08 J2.17
P0_TX-
  Top 0.254: M1.44 45.72,2.54 J2.18
P4_RX+
  Top 0.254: M1.36 29.41,4.01 28.07,2.67 25.53,2.67 J2.10
P4_RX-
  Top 0.254: M1.37 31.44,4.01 30.1,2.67 28.7,2.67 27.3,1.27 J2.11
P4_TX+
  Top 0.254: M1.38 33.35,4.01 32,2.67 30.73,2.67 29.34,1.27 J2.12
P4_TX-
  Top 0.254: M1.39 35.38,4.01 34.04,2.67 33.15,2.67 J2.13
PE
  Top 1.016: S1.SH$3 S1.SH$1 1.56,20.57 5.46,20.57 5.59,20.45 C2.1 | S1.SH$3 S1.SH$2 | S1.SH$3 S1.SH$4
SPDIF_OUT  (via drill 0.3 pad 0.03)
  Top 0.203: M1.29 17.22,8.31 18.61,6.92 | 18.61,6.92 18.67,6.86 v18.67,6.48 | 18.61,6.92 18.52,6.5 v18.67,6.48 | 18.61,6.92 18.8,6.54 v18.67,6.48
  Bottom 0.203: 18.54,6.04 18.54,6.35 v18.67,6.48 | 18.54,6.04 18.54,5.84 16.76,4.06 14.61,4.06 14.22,3.68 12.32,3.68 11.94,3.3 9.91,3.3 9.53,2.92 7.49,2.92 7.11,2.54 5.08,2.54 J2.2 | 18.54,6.04 18.79,6.39 v18.67,6.48 | 18.54,6.04 18.52,6.47 v18.67,6.48
SPI_CLK
  Top 0.203: M1.46 49.72,2.48 49.53,2.29 J2.20
SPI_CS
  Top 0.203: M1.48 53.72,3.18 54.61,2.29 J2.22
SPI_MISO
  Top 0.203: M1.49 55.72,3.84 57.15,2.41 J2.23
SPI_MOSI
  Top 0.203: M1.47 51.72,2.76 52.07,2.41 J2.21
SW
  pour Top (no thermals): 9.63,11.76 9.6,14.61 10.69,14.61 10.69,12.8 9.91,12.8 9.68,12.57 9.68,11.76
TXD
  Top 0.203: U4.2 10.16,25.15 11.68,23.62 U3.21
UART_CTS  (via drill 0.3 pad 0.03)
  Top 0.203: v56.77,18.54 57.22,18.54 | 57.22,18.54 58.19,18.54 M1.56 | 57.22,18.54 56.82,18.68 v56.77,18.54 | 57.22,18.54 56.82,18.4 v56.77,18.54
  Bottom 0.203: v56.77,18.54 56.45,18.86 | 56.45,18.86 56.01,19.3 22.61,19.3 21.21,20.7 21.21,25.53 18.8,27.94 12.19,27.94 11.3,28.83 10.29,28.83 8.89,30.23 J1.4 | 56.45,18.86 56.63,18.48 v56.77,18.54 | 56.45,18.86 56.83,18.68 v56.77,18.54
UART_RTS  (via drill 0.3 pad 0.03)
  Top 0.203: M1.55 57.22,16.51 | 57.22,16.51 v56.77,16.51 | 11.3,28.69 R15.2 11.43,29.08 J1.5 | 11.3,28.69 11.3,28.32 | 11.3,28.32 C20.1 | C20.1 | 11.3,27.81 8.76,27.81 7.37,26.42 3.48,26.42 SW1.2 | v11.05,28.32 11.3,28.32 | 57.22,16.51 56.82,16.65 v56.77,16.51 | 57.22,16.51 56.82,16.37 v56.77,16.51 | 11.3,28.69 10.96,28.44 v11.05,28.32 | 11.3,28.69 11.19,28.28 v11.05,28.32 | C20.1 11.19,28.36 v11.05,28.32 | C20.1 10.96,28.2 v11.05,28.32
  Top 0.254: 11.3,27.81 C20.1
  Bottom 0.203: 11.37,28 11.81,27.56 18.67,27.56 20.83,25.4 20.83,20.57 22.48,18.92 54.36,18.92 56.45,16.83 | 11.37,28 v11.05,28.32 | v56.77,16.51 56.45,16.83 | 56.45,16.83 56.63,16.45 v56.77,16.51 | 56.45,16.83 56.83,16.64 v56.77,16.51 | 11.37,28 11.18,28.39 v11.05,28.32 | 11.37,28 10.98,28.19 v11.05,28.32
UART_RX  (via drill 0.3 pad 0.03)
  Top 0.203: 12.01,24.5 U4.4 11.91,24.51 12.01,24.51 | 12.01,24.5 12.05,24.5 | M1.20 17.25,26.54 18.17,26.54 | 18.17,26.54 18.29,26.54 v18.54,26.29 | 12.01,24.51 12.32,24.51 v12.45,24.38 | 12.01,24.5 12.36,24.26 v12.45,24.38 | 12.01,24.5 12.43,24.53 v12.45,24.38 | 12.01,24.51 12.36,24.26 v12.45,24.38 | 12.01,24.51 12.44,24.53 v12.45,24.38 | 18.17,26.54 18.42,26.2 v18.54,26.29 | 18.17,26.54 18.58,26.43 v18.54,26.29
  Bottom 0.203: v12.45,24.38 12.76,24.07 | 12.76,24.07 12.95,23.88 17.27,23.88 17.91,24.51 17.91,25.65 18.22,25.97 | 18.22,25.97 v18.54,26.29 | J1.3 6.86,31.75 12.19,26.42 12.19,24.75 | v12.45,24.38 12.19,24.64 12.19,24.75 | 12.76,24.07 12.58,24.45 v12.45,24.38 | 12.76,24.07 12.38,24.25 v12.45,24.38 | 12.19,24.75 12.3,24.34 v12.45,24.38 | 12.19,24.75 12.53,24.5 v12.45,24.38 | 18.22,25.97 18.61,26.16 v18.54,26.29 | 18.22,25.97 18.41,26.35 v18.54,26.29
UART_TX  (via drill 0.3 pad 0.03)
  Top 0.203: v18.41,24.51 17.96,24.51 | 17.96,24.51 M1.21 | v12.19,23.62 12.19,23.17 | 12.19,23.17 12.19,23.04 U3.20 | 17.96,24.51 18.37,24.37 v18.41,24.51 | 17.96,24.51 18.37,24.65 v18.41,24.51 | 12.19,23.17 12.33,23.57 v12.19,23.62 | 12.19,23.17 12.05,23.57 v12.19,23.62
  Bottom 0.203: v12.19,23.62 11.87,23.94 | 11.87,23.94 11.81,24 11.81,26.29 11.18,26.92 10.41,26.92 9.53,26.04 5.33,26.04 3.81,27.56 J1.2 | v18.41,24.51 17.4,23.5 12.62,23.5 | 12.62,23.5 12.32,23.5 v12.19,23.62 | 11.87,23.94 12.06,23.56 v12.19,23.62 | 11.87,23.94 12.26,23.76 v12.19,23.62 | 12.62,23.5 12.28,23.74 v12.19,23.62 | 12.62,23.5 12.2,23.47 v12.19,23.62
USB_N
  Top 0.368: 65.77,2.29 65.78,2.29 | 65.78,2.29 65.78,3.19 64.38,4.59 64.38,6.12 59.28,11.22 58.95,11.22 58.24,10.51 | J2.26 65.78,2.28 65.78,2.29
  Top 0.381: M1.52 58.24,10.51
USB_P
  Top 0.368: J2.27 66.3,2.28 66.3,3.41 64.9,4.81 64.9,6.33 59.47,11.77 58.96,11.77 M1.53
VBUS  (via drill 0.3)
  Top 0.254: U3.7 10.41,19.13 U3.8
  Top 0.368: C13.1 11.43,17.91 10.41,18.92
  Top 0.508: C13.1 C12.1 9.68,15.14 7.34,15.14 6.6,15.88 5.87,15.88 D1.4 5.25,15.87 v5.21,15.82
  Top 0.762: 10.41,18.92 10.41,19.13
  Bottom 0.508: v5.21,15.82 5.13,15.75 4.78,15.75
  Bottom 1.27: v4.78,19.46 4.78,15.75 4.78,12.32 v5.71,12.32
  other vias: 4.75,18.69 4.75,17.93 4.83,12.32
  pour Top (no thermals): 3.02,17.7 5,17.7 5.33,18.03 5.33,19.68 2.92,19.68 2.92,17.75
  pour Top (no thermals): 5.84,9.78 5.84,11.56 6.22,11.94 6.22,12.7 4.06,12.7 4.06,9.78
VDD
  Top 0.203: C10.1 9.65,17.91 | 9.65,17.91 C9.1 9.48,17.91 | U3.6 9.65,19.66 9.65,17.91
VIN
  pour Top (no thermals): 5.71,8.38 1.14,8.38 1.14,6.22 2.41,6.22 2.54,6.1 3.17,6.1 3.17,7.24 5.71,7.24
XLNA  (via drill 0.3 pad 0.03)
  Top 0.203: M1.5 47.72,28.26 | 47.72,28.26 47.72,27.85 v47.75,27.81 | 47.72,28.26 47.61,27.85 v47.75,27.81 | 47.72,28.26 47.89,27.87 v47.75,27.81
  Bottom 0.203: v47.75,27.81 48.07,28.13 | 48.07,28.13 48.9,28.96 51.18,28.96 51.94,29.72 53.85,29.72 54.23,30.1 56.13,30.1 56.52,30.48 66.04,30.48 J1.27 | 48.07,28.13 47.69,27.95 v47.75,27.81 | 48.07,28.13 47.89,27.75 v47.75,27.81

### Text on the board
tPlace: Rev.
bPlace: RX | +5V | TX | CTS | RTS | GND | +3V3 | +3V3 | LED0 | LED1 | LED2 | LED3 | LED4 | LED5 | LED6 | LED7 | LED8 | GND | +3V3 | TDO | TDI | TCK | TMS | !RESET_L | GPIO24 | FLASH_WP | XLNA | GND | UART | LED | JTAG | Rev. | c 2014-2015, Domino Team / All rights reserved. | Licensed under a Creative Commons / Attribution-Share-Alike Unported License. / See creativecommons.org/licenses/by-sa/4.0/ | I2S | ETH_P4 | ETH_P0 | SPI | USB | MCK | D- | GND | SPDIF_OUT | MICIN | SD | WS | CK | +3V3 | GND | RX+ | RX- | TX+ | TX- | +2VA_ETH_OUT | RX+ | RX- | TX+ | TX- | +3V3 | CLK | MOSI | CS | MISO | GND | +5V | D+ | GND
Document: DRILL CHART: TOP TO BOTTOM | LINE WIDTH IMPEDANCE CHART FOR REFERENCE | Class | RF | Type | Coated Coplanar Waveguide With Ground 1B | Layer | Impedance | Trace Width | Trace Separation | Ground Separation | TOP, / BOTTOM | 50 Ohms | 26 mils | N/A | 6 mils | Class | USB | Type | Diff Coated Coplanar Waveguide With Ground 1B | Layer | Impedance | Trace Width | Trace Separation | Ground Separation | TOP, / BOTTOM | 90 Ohms | 14.5 mils | 6 mils | 6 mils | Class | Ethernet | Type | Diff Coated Coplanar Waveguide With Ground 1B | Layer | Impedance | Trace Width | Trace Separation | Ground Separation | TOP, / BOTTOM | 100 Ohms | 10 mils | 6 mils | 6 mils | STACK-UP FOR REFERENCE | LAYER 1 L1 TOP | 18 UM CU + 12.5 UM PLATING (30.5 UM) | 1.061 MM+/-10% | CORE | 1.0 MM CORE FR-4 LG 135 / INCLUDING COPPER | LAYER 4 L16 BOTTOM | 18 UM CU + 12.5 UM PLATING (30.5 UM) | NOTES: | 1. PRINTED CIRCUIT BOARD MADE FROM NEMA GRADE FR-4 TG 135 EPOXY / LAMINATE WITH 18 UM COPPER PLATING AND 1 MM THICKNESS. | 2. ALL DIMENSIONS ARE GIVEN IN MILLIMETERS EXCEPT TRACE WIDTH/SPACE. | 3. CIRCUIT PATHS ARE FOR REFERENCE ONLY. | 4. HOLE SIZES SHOWN ARE FINISHED DIAMETERS AFTER PLATING. | 5. BOARD PLATED USING REFLOW OR SIMILAR METHOD. | 6. BOARD TO HAVE WHITE SOLDER MASK ON PLATED SURFACES USING WET / FILM SR100 OR SR1010 EPOXY. / EQUIVALENT WET OR DRY FILM MAY BE USED. | 7. SILKSCREEN BOARD USING BLACK INK. DISTORTION OF SILKSCREEN / IS ACCEPTABLE OVER TRACES. EPOXY INK ON PLATED LANDS IS NOT / ACCEPTABLE | 8. THE FOLLOWING INFORMATION APPLIES TO THIS BOARD: | * 2 COPPER LAYERS | * 1 MM BOARD THICKNESS | * REQUIRES TOP AND BOTTOM SIDE SILKSCREENS | © 2014-2015, The Domino Team. / All rights reserved. | Licensed under a Creative Commons / Attribution-Share-Alike Unported License. / See creativecommons.org/licenses/by-sa/4.0/ | Reference designs are provided "AS IS" and "WITH ALL FAULTS". / The Domino Team disclaims all other warranties express or implied, / regarding this product, including but not limited to, any implied warranties of / merchantibility or fitness for any particular application. | The Domino Team may make changes to specifications and product descriptions / at any time, without notice. | Rev.
DrillLegend: LAYER-STACK
DrillLegend_01-16: 01-16
DrillLegend_01-20: 01-20
Pinout: UART | LED | JTAG | +5V | UART_TX | UART_RX | UART_CTS | UART_RTS | GND | +3v3 | +3v3 | LED0 | LED1 | LED2 | LED3 | LED4 | LED5 | LED6 | LED7 | LED8 | GND | +2V5 | JTAG_TDO | JTAG_TDI | JTAG_TCK | JTAG_TMS | !RESET_L | GPIO24 | FLASH_WP | XLNA | GND | GND | SPDIF_OUT | I2S_MICIN | I2S_MCK | I2S_SD | I2S_WS | I2S_CK | +3V3 | GND | P4_RX+ | P4_RX- | P4_TX+ | P4_TX- | +2VA_ETH_OUT | P0_RX+ | P0_RX- | P0_TX+ | P0_TX- | +3V3 | SPI_CLK | SPI_MOSI | SPI_CS | SPI_MISO | GND | +5V | USB- | USB+ | GND | I2S | ETH4 | ETH0 | SPI | USB | Pinout (.PIN)
Component_side: Component Side (.CMP)
Solder_side: Solder side (.SOL)
Silk_screen_CMP: Silk screen CMP (.PLC)
Silk_screen_SOL: Silk screen SOL (.PLS)
Solder_stop_mask_CMP: Solder stop mask CMP (.STC)
Solder_stop_mask_SOL: Solder stop mask SOL (.STS)
Cream_frame_CMP: Cream frame CMP (.CRC)
Cream_frame_SOL: Cream frame SOL (.CRS)
Drill_data: Drill data (.DRD)
Component_Assembly_CMP: Component Assembly CMP (.ASC)
Component_Assembly_SOL: Component Assembly SOL (.ASS)
Outline: Outline (.OLN)